# Altium schematic sheet Sheet2.SchDoc
size A; Author: Zachary Cummins; DrawnBy: Zachary Cummins; SheetNumber: 1; SheetTotal: 1
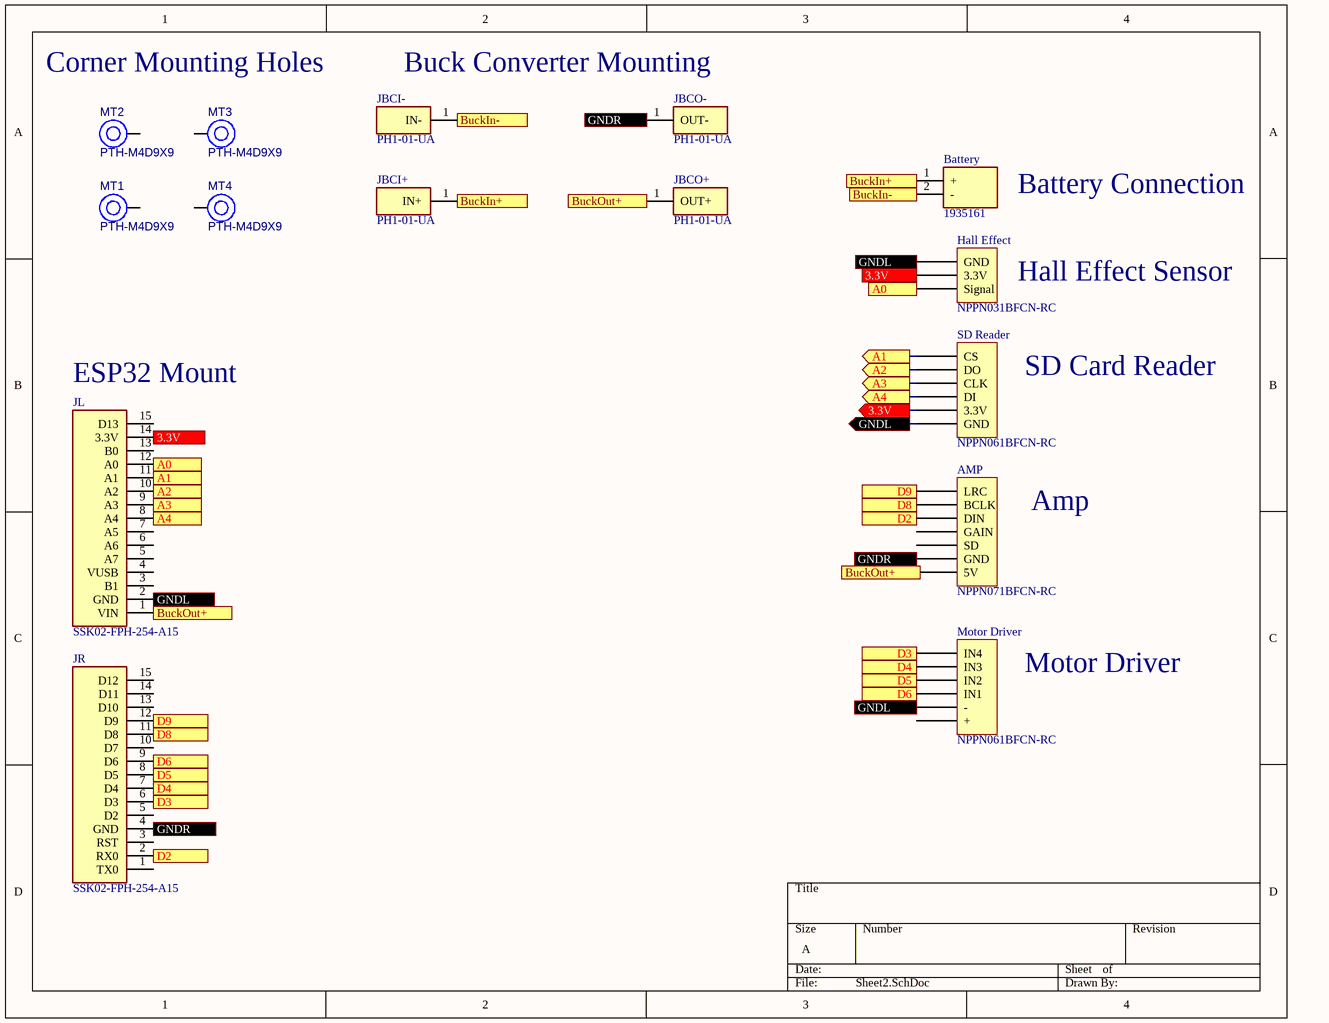
[diagram p0: Sheet2.SchDoc]

## Parts
AMP  NPPN071BFCN-RC  [SULLINS NPPN071BFCN]
Battery  1935161  [1935161]
Hall_Effect  NPPN031BFCN-RC  [SULLINS NPPN031BFCN]
JBCI+  PH1-01-UA  [HDRV1W64P0X254_1X1_254X250X888P]
JBCI-  PH1-01-UA  [HDRV1W64P0X254_1X1_254X250X888P]
JBCO+  PH1-01-UA  [HDRV1W64P0X254_1X1_254X250X888P]
JBCO-  PH1-01-UA  [HDRV1W64P0X254_1X1_254X250X888P]
JL  SSK02-FPH-254-A15  [RHDR15W69P0X254_1X15_3860X250X870P]
JR  SSK02-FPH-254-A15  [RHDR15W69P0X254_1X15_3860X250X870P]
Motor_Driver  NPPN061BFCN-RC  [SULLINS NPPN061BFCN]
MT1  PTH-M4D9X9  [PTH-M4D9X9]
MT2  PTH-M4D9X9  [PTH-M4D9X9]
MT3  PTH-M4D9X9  [PTH-M4D9X9]
MT4  PTH-M4D9X9  [PTH-M4D9X9]
SD_Reader  NPPN061BFCN-RC  [SULLINS NPPN061BFCN]

## Ports
3.3V (in), 3.3V (out), A0 (in), A0 (out), A1 (in), A1 (out), A2 (in), A2 (out), A3 (in), A3 (out), A4 (in), A4 (out), BuckIn+ (in), BuckIn+ (out), BuckIn- (in), BuckIn- (out), BuckOut+ (in), BuckOut+ (out), D2 (in), D2 (out), D3 (in), D3 (out), D4 (in), D4 (out), D5 (in), D5 (out), D6 (in), D6 (out), D8 (in), D8 (out), D9 (in), D9 (out), GNDL (in), GNDL (out), GNDR (in), GNDR (out)

## Nets
3.3V: Hall_Effect.2(3.3V) JL.14(3.3V) SD_Reader.2(3.3V) ; port 3.3V
A0: Hall_Effect.1(Signal) JL.12(A0) ; port A0
A1: JL.11(A1) SD_Reader.6(CS) ; port A1
A2: JL.10(A2) SD_Reader.5(DO) ; port A2
A3: JL.9(A3) SD_Reader.4(CLK) ; port A3
A4: JL.8(A4) SD_Reader.3(DI) ; port A4
BuckIn+: Battery.1(+) JBCI+.1(IN+) ; port BuckIn+
BuckIn-: Battery.2(-) JBCI-.1(IN-) ; port BuckIn-
BuckOut+: JBCO+.1(OUT+) JL.1(VIN) ; port BuckOut+
D2: AMP.5(DIN) JR.2(RX0) ; port D2
D3: JR.6(D3) Motor_Driver.6(IN4) ; port D3
D4: JR.7(D4) Motor_Driver.5(IN3) ; port D4
D5: JR.8(D5) Motor_Driver.4(IN2) ; port D5
D6: JR.9(D6) Motor_Driver.3(IN1) ; port D6
D8: AMP.6(BCLK) JR.11(D8) ; port D8
D9: AMP.7(LRC) JR.12(D9) ; port D9
GNDL: Hall_Effect.3(GND) JL.2(GND) Motor_Driver.2(-) SD_Reader.1(GND) ; port GNDL
GNDR: AMP.2(GND) JBCO-.1(OUT-) JR.4(GND) ; port GNDR

Not connected (* = marked no-connect by the designer): AMP 1(5V) 3(SD) 4(GAIN); JL 3(B1) 4(VUSB) 5(A7) 6(A6) 7(A5) 13(B0) 15(D13); JR 1(TX0) 3(RST) 5(D2) 10(D7) 13(D10) 14(D11) 15(D12); Motor_Driver 1(+); MT1 1; MT2 1; MT3 1; MT4 1

## Notes on the sheet
- Corner Mounting Holes
- Buck Converter Mounting
- Battery Connection
- Hall Effect Sensor
- (near JL) ESP32 Mount
- SD Card Reader
- Amp
- Motor Driver

## Library data of the parts
AMP = NPPN071BFCN-RC: CONN HDR 7POS 0.079 GOLD PCB; Manufacturer: Sullins Connector Solutions; Connector Type: Header; Contact Length - Post: 0.094" (2.40mm); Current Rating (Amps): 2A; Material Flammability Rating: UL94 V-0; Number of Positions: 7; Number of Positions Loaded: All; Pitch - Mating: 0.079" (2.00mm); Style: Board to Board; Part Number: NPPN071BFCN-RC; ComponentLink1Description: Datasheet; ComponentLink1URL: https://drawings-pdf.s3.amazonaws.com/10483.pdf; ComponentLink2Description: DigiKey Link; ComponentLink2URL: https://www.digikey.com/en/products/detail/sullins-connector-solutions/NPPN071BFCN-RC/804809; Contact Finish - Mating: Gold; Contact Finish - Post: Gold; Contact Finish Thickness - Mating: Flash; Contact Type: Female Socket; Fastening Type: Push-Pull; Insulation Color: Black; Insulation Height: 0.173" (4.40mm); LastUpdated: 6/21/2022 2:43:39 PM; Lifecycle Status: Active; Minimum Order: 1; Mounting Type: Through Hole; Number of Rows: 1; Operating Temperature: -40°C ~ 105°C; Packaging: Tube; Part Status: Active; Price: 0.42; Series: -; Supplier 1: DigiKey; Supplier Part Number 1: S5751-07-ND; Termination: Solder
Battery = 1935161: Connector; Manufacturer_Name: Phoenix Contact; Datasheet Link: https://www.phoenixcontact.com/en-us/products/printed-circuit-board-terminal-pt-15-2-50-h-1935161?type=pdf; Height: 11.55mm; Manufacturer_Part_Number: 1935161; Mouser Part Number: 651-1935161; Mouser Price/Stock: https://www.mouser.co.uk/ProductDetail/Phoenix-Contact/1935161?qs=W3wJikR1%252BS6eKzfFl8Rbew%3D%3D; Arrow Part Number: 1935161; Arrow Price/Stock: https://www.arrow.com/en/products/1935161/phoenix-contact?utm_currency=USD&region=nac
Hall_Effect = NPPN031BFCN-RC: CONN HDR 3POS 0.079 GOLD PCB; Manufacturer: Sullins Connector Solutions; Connector Type: Header; Contact Length - Post: 0.094" (2.40mm); Current Rating (Amps): 2A; Material Flammability Rating: UL94 V-0; Number of Positions: 3; Number of Positions Loaded: All; Pitch - Mating: 0.079" (2.00mm); Style: Board to Board; Part Number: NPPN031BFCN-RC; ComponentLink1Description: Datasheet; ComponentLink1URL: https://drawings-pdf.s3.amazonaws.com/10483.pdf; ComponentLink2Description: DigiKey Link; ComponentLink2URL: https://www.digikey.com/en/products/detail/sullins-connector-solutions/NPPN031BFCN-RC/804805; Contact Finish - Mating: Gold; Contact Finish - Post: Gold; Contact Finish Thickness - Mating: Flash; Contact Type: Female Socket; Fastening Type: Push-Pull; Insulation Color: Black; Insulation Height: 0.173" (4.40mm); LastUpdated: 6/21/2022 2:42:20 PM; Lifecycle Status: Active; Minimum Order: 1; Mounting Type: Through Hole; Number of Rows: 1; Operating Temperature: -40°C ~ 105°C; Packaging: Tube; Part Status: Active; Price: 0.25; Series: -; Supplier 1: DigiKey; Supplier Part Number 1: S5751-03-ND; Termination: Solder
JBCI+ JBCI- JBCO+ JBCO- = PH1-01-UA: Connector; Manufacturer_Name: Adam Tech; Datasheet Link: https://app.adam-tech.com/products/download/data_sheet/201605/ph1-xx-ua-data-sheet.pdf; Height: 8.881mm; Manufacturer_Part_Number: PH1-01-UA; Mouser Part Number: 737-PH1-01-UA; Mouser Price/Stock: https://www.mouser.co.uk/ProductDetail/Adam-Tech/PH1-01-UA?qs=HoCaDK9Nz5d5oFPj3mhtaw%3D%3D; Arrow Part Number: PH1-01-UA; Arrow Price/Stock: https://www.arrow.com/en/products/ph1-01-ua/adam-tech?utm_currency=USD&region=nac
JL JR = SSK02-FPH-254-A15: Connector; Manufacturer_Name: Same Sky; Datasheet Link: https://www.sameskydevices.com/product/resource/ssk02-fph-254.pdf; Height: 8.7mm; Manufacturer_Part_Number: SSK02-FPH-254-A15
Motor_Driver SD_Reader = NPPN061BFCN-RC: CONN HDR 6POS 0.079 GOLD PCB; Manufacturer: Sullins Connector Solutions; Connector Type: Header; Contact Length - Post: 0.094" (2.40mm); Current Rating (Amps): 2A; Material Flammability Rating: UL94 V-0; Number of Positions: 6; Number of Positions Loaded: All; Pitch - Mating: 0.079" (2.00mm); Style: Board to Board; Part Number: NPPN061BFCN-RC; ComponentLink1Description: Datasheet; ComponentLink1URL: https://drawings-pdf.s3.amazonaws.com/10483.pdf; ComponentLink2Description: DigiKey Link; ComponentLink2URL: https://www.digikey.com/en/products/detail/sullins-connector-solutions/NPPN061BFCN-RC/804808; Contact Finish - Mating: Gold; Contact Finish - Post: Gold; Contact Finish Thickness - Mating: Flash; Contact Type: Female Socket; Fastening Type: Push-Pull; Insulation Color: Black; Insulation Height: 0.173" (4.40mm); LastUpdated: 6/21/2022 2:43:22 PM; Lifecycle Status: Active; Minimum Order: 1; Mounting Type: Through Hole; Number of Rows: 1; Operating Temperature: -40°C ~ 105°C; Packaging: Tube; Part Status: Active; Price: 0.40; Series: -; Supplier 1: DigiKey; Supplier Part Number 1: S5751-06-ND; Termination: Solder
MT1-MT4 = CMP-00028-00010-5: M4 PTH (4.5mm hole, ISO 273), 9mm pad; Pins: 1